# EAGLE design Mainboard (EAGLE 8.1.0)
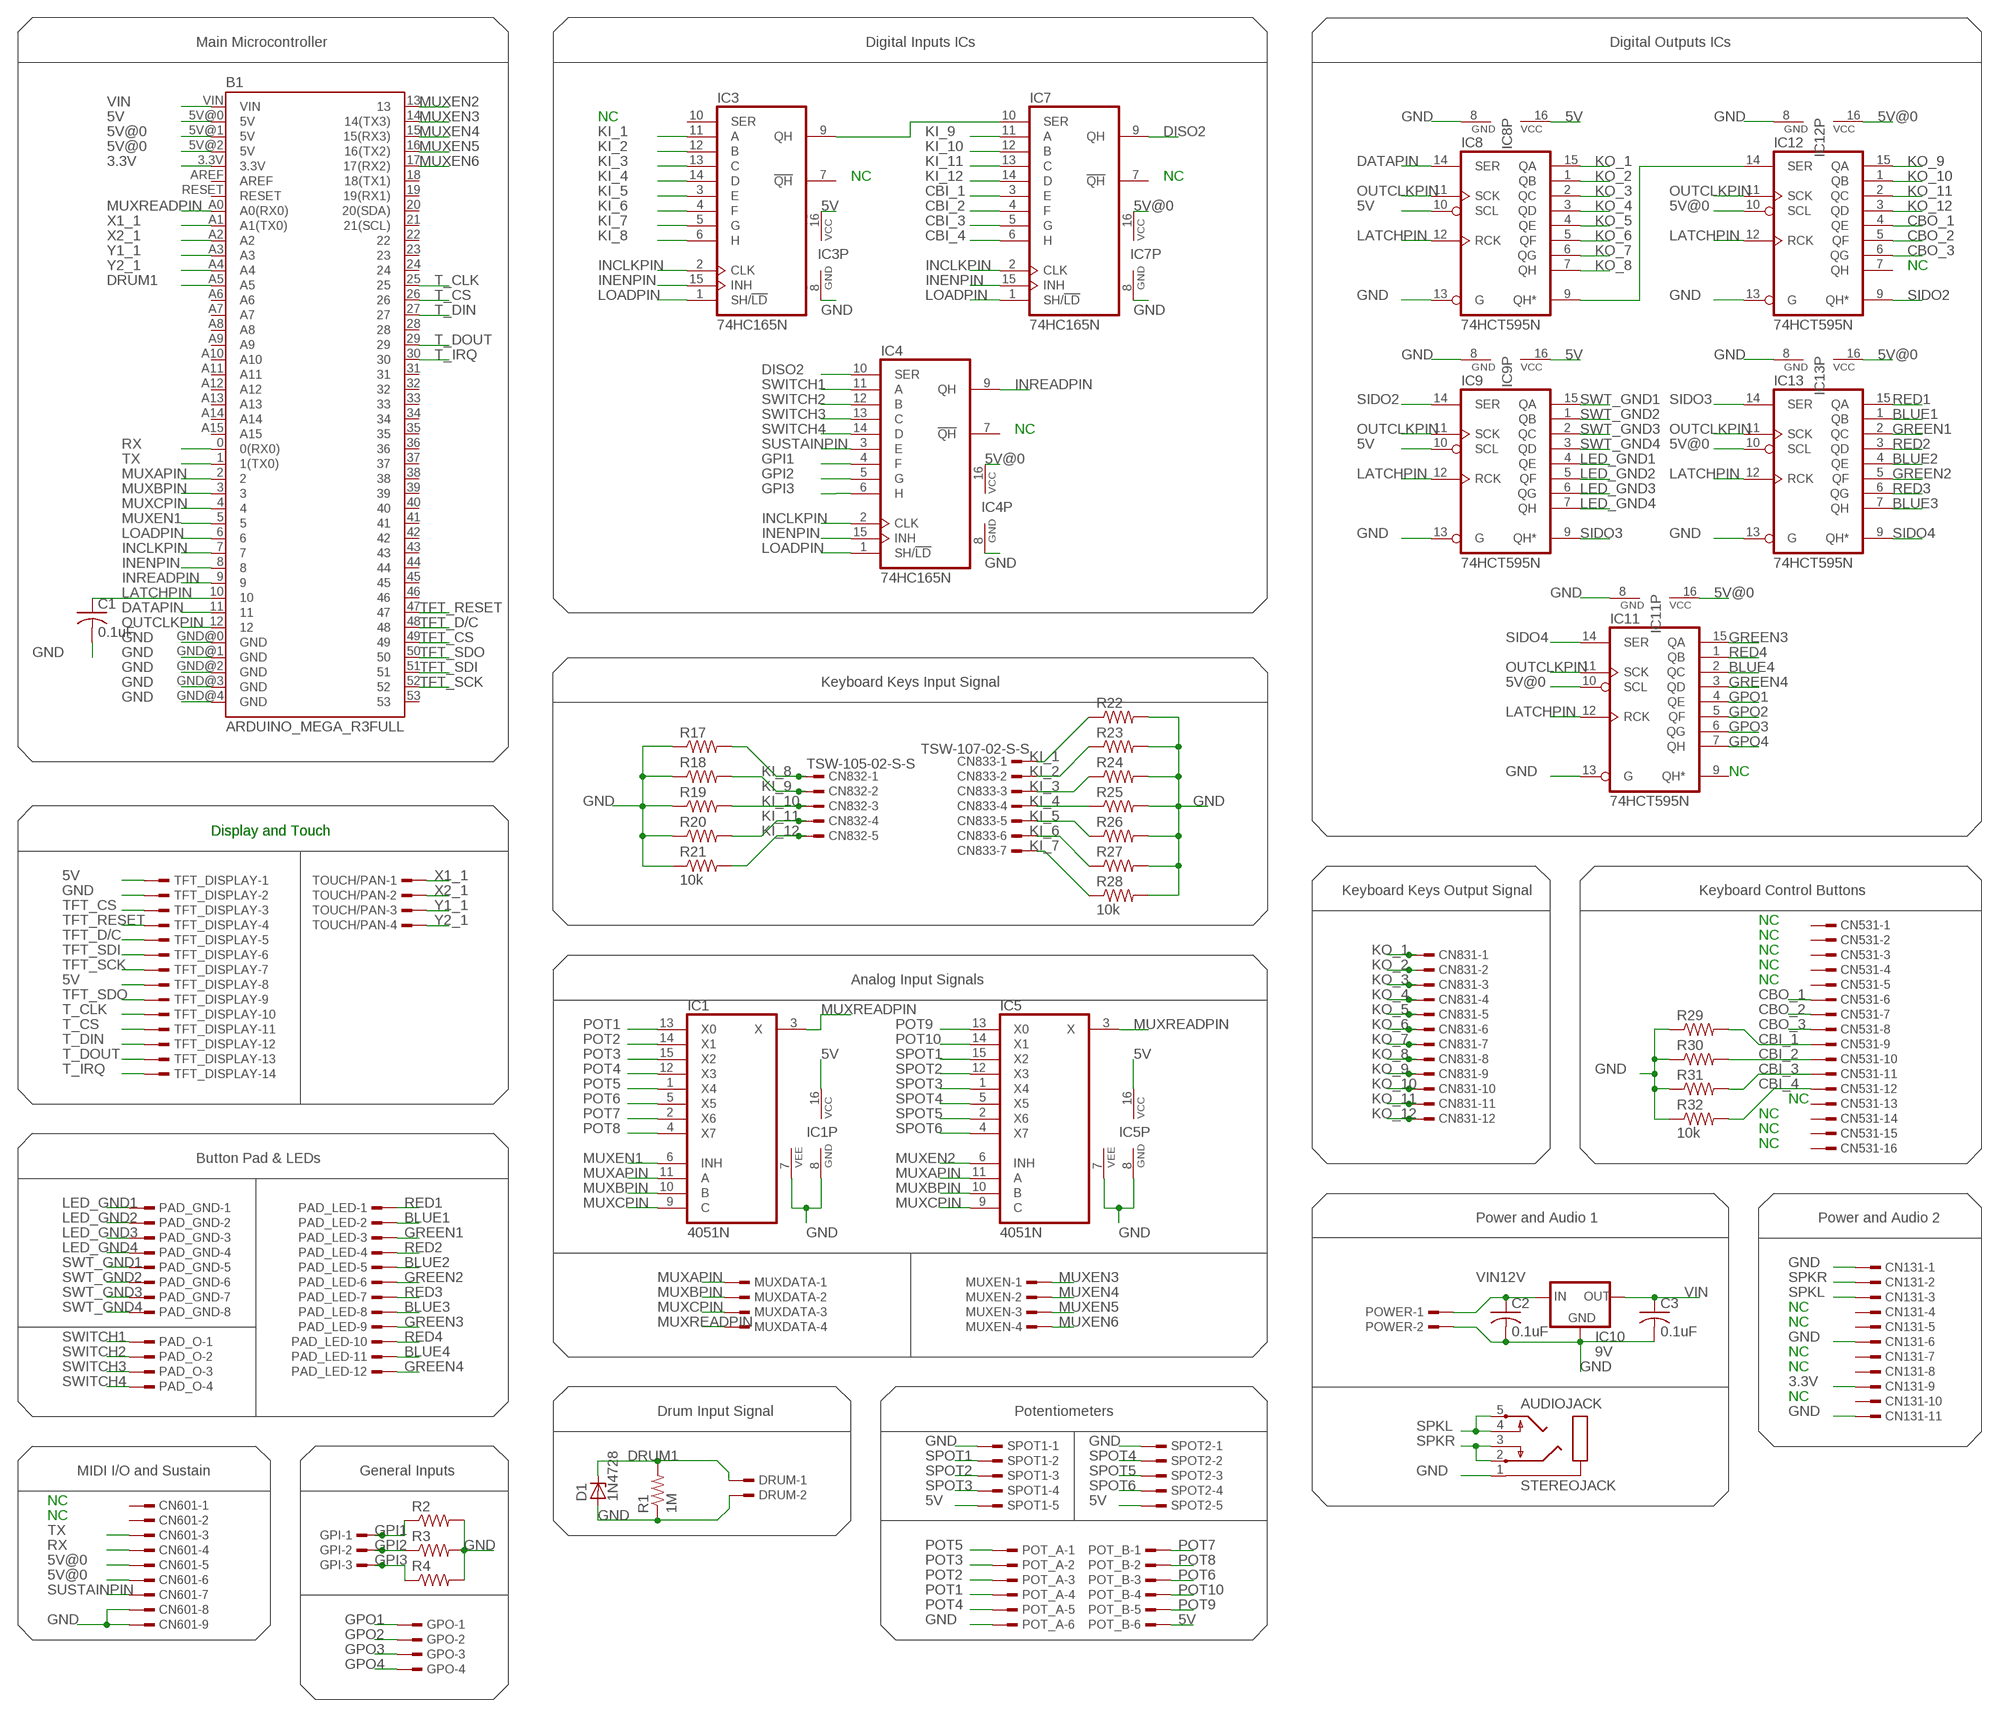
[diagram p0: schematic, sheet 1]

## Parts
AUDIOJACK  STEREOJACK  [STX3100]
B1  ARDUINO_MEGA_R3FULL  [ARDUINO_MEGA]
C1  0.1uF  C-US050-075X075  [C050-075X075]
C2  0.1uF  C-US050-075X075  [C050-075X075]
C3  0.1uF  C-US050-075X075  [C050-075X075]
CN131  TSW-111-02-S-S  [TSW-111-02-S-S]
CN531  TSW-116-02-S-S  [TSW-116-02-S-S]
CN601  TSW-109-02-S-S  [TSW-109-02-S-S]
CN831  TSW-112-02-S-S  [TSW-112-02-S-S]
CN832  TSW-105-02-S-S  [TSW-105-02-S-S]
CN833  TSW-107-02-S-S  [TSW-107-02-S-S]
D1  1N4728  [DO41Z10]
DRUM  TSW-102-02-S-S  [TSW-102-02-S-S]
GPI  TSW-103-02-S-S  [TSW-103-02-S-S]
GPO  TSW-104-02-S-S  [TSW-104-02-S-S]
IC1  4051N  [DIL16]
IC3  74HC165N  [DIL16]
IC4  74HC165N  [DIL16]
IC5  4051N  [DIL16]
IC7  74HC165N  [DIL16]
IC8  74HCT595N  [DIL16]
IC9  74HCT595N  [DIL16]
IC10  9V  78XXL  [78XXL]
IC11  74HCT595N  [DIL16]
IC12  74HCT595N  [DIL16]
IC13  74HCT595N  [DIL16]
MUXDATA  TSW-104-02-S-S  [TSW-104-02-S-S]
MUXEN  TSW-104-02-S-S  [TSW-104-02-S-S]
PAD_GND  TSW-108-02-S-S  [TSW-108-02-S-S]
PAD_LED  TSW-112-02-S-S  [TSW-112-02-S-S]
PAD_O  TSW-104-02-S-S  [TSW-104-02-S-S]
POT_A  TSW-106-02-S-S  [TSW-106-02-S-S]
POT_B  TSW-106-02-S-S  [TSW-106-02-S-S]
POWER  TSW-102-02-S-S  [TSW-102-02-S-S]
R1  1M  R-US_0309/12  [0309/12]
R2  10k  R-US_0309/12  [0309/12]
R3  10k  R-US_0309/12  [0309/12]
R4  10k  R-US_0309/12  [0309/12]
R17  10k  R-US_0309/12  [0309/12]
R18  10k  R-US_0309/12  [0309/12]
R19  10k  R-US_0309/12  [0309/12]
R20  10k  R-US_0309/12  [0309/12]
R21  10k  R-US_0309/12  [0309/12]
R22  10k  R-US_0309/12  [0309/12]
R23  10k  R-US_0309/12  [0309/12]
R24  10k  R-US_0309/12  [0309/12]
R25  10k  R-US_0309/12  [0309/12]
R26  10k  R-US_0309/12  [0309/12]
R27  10k  R-US_0309/12  [0309/12]
R28  10k  R-US_0309/12  [0309/12]
R29  10k  R-US_0309/12  [0309/12]
R30  10k  R-US_0309/12  [0309/12]
R31  10k  R-US_0309/12  [0309/12]
R32  10k  R-US_0309/12  [0309/12]
SPOT1  TSW-105-02-S-S  [TSW-105-02-S-S]
SPOT2  TSW-105-02-S-S  [TSW-105-02-S-S]
TFT_DISPLAY  TSW-114-02-S-S  [TSW-114-02-S-S]
TOUCH/PAN  TSW-104-02-S-S  [TSW-104-02-S-S]

## Nets
3.3V: B1.3.3V CN131.9
5V: B1.5V@0(5V) IC1.16(VCC) IC3.16(VCC) IC5.16(VCC) IC8.10(SCL) IC8.16(VCC) IC9.10(SCL) IC9.16(VCC) POT_B.6 SPOT1.5 SPOT2.5 TFT_DISPLAY.1 TFT_DISPLAY.8
5V@0: B1.5V@1(5V) B1.5V@2(5V) CN601.5 CN601.6 IC4.16(VCC) IC7.16(VCC) IC11.10(SCL) IC11.16(VCC) IC12.10(SCL) IC12.16(VCC) IC13.10(SCL) IC13.16(VCC)
BLUE1: IC13.1(QB) PAD_LED.2
BLUE2: IC13.4(QE) PAD_LED.5
BLUE3: IC13.7(QH) PAD_LED.8
BLUE4: IC11.2(QC) PAD_LED.11
CBI_1: CN531.9 IC7.3(E) R29.2
CBI_2: CN531.10 IC7.4(F) R30.2
CBI_3: CN531.11 IC7.5(G) R31.2
CBI_4: CN531.12 IC7.6(H) R32.2
CBO_1: CN531.6 IC12.4(QE)
CBO_2: CN531.7 IC12.5(QF)
CBO_3: CN531.8 IC12.6(QG)
DATAPIN: B1.11 IC8.14(SER)
DISO1: IC3.9(QH) IC7.10(SER)
DISO2: IC4.10(SER) IC7.9(QH)
DRUM1: B1.A5 D1.C DRUM.1 R1.2
GND: AUDIOJACK.1 B1.GND@0(GND) B1.GND@1(GND) B1.GND@2(GND) B1.GND@3(GND) B1.GND@4(GND) C1.2 C2.2 C3.2 CN131.1 CN131.6 CN131.11 CN601.8 CN601.9 D1.A DRUM.2 IC1.7(VEE) IC1.8(GND) IC3.8(GND) IC4.8(GND) IC5.7(VEE) IC5.8(GND) IC7.8(GND) IC8.8(GND) IC8.13(G) IC9.8(GND) IC9.13(G) IC10.GND IC11.8(GND) IC11.13(G) IC12.8(GND) IC12.13(G) IC13.8(GND) IC13.13(G) POT_A.6 POWER.2 R1.1 R2.2 R3.2 R4.2 R17.1 R18.1 R19.1 R20.1 R21.1 R22.2 R23.2 R24.2 R25.2 R26.2 R27.2 R28.2 R29.1 R30.1 R31.1 R32.1 SPOT1.1 SPOT2.1 TFT_DISPLAY.2
GPI1: GPI.1 IC4.4(F) R2.1
GPI2: GPI.2 IC4.5(G) R3.1
GPI3: GPI.3 IC4.6(H) R4.1
GPO1: GPO.1 IC11.4(QE)
GPO2: GPO.2 IC11.5(QF)
GPO3: GPO.3 IC11.6(QG)
GPO4: GPO.4 IC11.7(QH)
GREEN1: IC13.2(QC) PAD_LED.3
GREEN2: IC13.5(QF) PAD_LED.6
GREEN3: IC11.15(QA) PAD_LED.9
GREEN4: IC11.3(QD) PAD_LED.12
INCLKPIN: B1.7 IC3.2(CLK) IC4.2(CLK) IC7.2(CLK)
INENPIN: B1.8 IC3.15(INH) IC4.15(INH) IC7.15(INH)
INREADPIN: B1.9 IC4.9(QH)
KI_1: CN833.1 IC3.11(A) R22.1
KI_2: CN833.2 IC3.12(B) R23.1
KI_3: CN833.3 IC3.13(C) R24.1
KI_4: CN833.4 IC3.14(D) R25.1
KI_5: CN833.5 IC3.3(E) R26.1
KI_6: CN833.6 IC3.4(F) R27.1
KI_7: CN833.7 IC3.5(G) R28.1
KI_8: CN832.1 IC3.6(H) R17.2
KI_9: CN832.2 IC7.11(A) R18.2
KI_10: CN832.3 IC7.12(B) R19.2
KI_11: CN832.4 IC7.13(C) R20.2
KI_12: CN832.5 IC7.14(D) R21.2
KO_1: CN831.1 IC8.15(QA)
KO_2: CN831.2 IC8.1(QB)
KO_3: CN831.3 IC8.2(QC)
KO_4: CN831.4 IC8.3(QD)
KO_5: CN831.5 IC8.4(QE)
KO_6: CN831.6 IC8.5(QF)
KO_7: CN831.7 IC8.6(QG)
KO_8: CN831.8 IC8.7(QH)
KO_9: CN831.9 IC12.15(QA)
KO_10: CN831.10 IC12.1(QB)
KO_11: CN831.11 IC12.2(QC)
KO_12: CN831.12 IC12.3(QD)
LATCHPIN: B1.10 C1.1 IC8.12(RCK) IC9.12(RCK) IC11.12(RCK) IC12.12(RCK) IC13.12(RCK)
LED_GND1: IC9.4(QE) PAD_GND.1
LED_GND2: IC9.5(QF) PAD_GND.2
LED_GND3: IC9.6(QG) PAD_GND.3
LED_GND4: IC9.7(QH) PAD_GND.4
LOADPIN: B1.6 IC3.1(SH/!LD) IC4.1(SH/!LD) IC7.1(SH/!LD)
MUXAPIN: B1.2 IC1.11(A) IC5.11(A) MUXDATA.1
MUXBPIN: B1.3 IC1.10(B) IC5.10(B) MUXDATA.2
MUXCPIN: B1.4 IC1.9(C) IC5.9(C) MUXDATA.3
MUXEN1: B1.5 IC1.6(INH)
MUXEN2: B1.13 IC5.6(INH)
MUXEN3: B1.14(14(TX3)) MUXEN.1
MUXEN4: B1.15(15(RX3)) MUXEN.2
MUXEN5: B1.16(16(TX2)) MUXEN.3
MUXEN6: B1.17(17(RX2)) MUXEN.4
MUXREADPIN: B1.A0(A0(RX0)) IC1.3(X) IC5.3(X) MUXDATA.4
N$4: IC8.9(QH*) IC12.14(SER)
OUTCLKPIN: B1.12 IC8.11(SCK) IC9.11(SCK) IC11.11(SCK) IC12.11(SCK) IC13.11(SCK)
POT1: IC1.13(X0) POT_A.4
POT2: IC1.14(X1) POT_A.3
POT3: IC1.15(X2) POT_A.2
POT4: IC1.12(X3) POT_A.5
POT5: IC1.1(X4) POT_A.1
POT6: IC1.5(X5) POT_B.3
POT7: IC1.2(X6) POT_B.1
POT8: IC1.4(X7) POT_B.2
POT9: IC5.13(X0) POT_B.5
POT10: IC5.14(X1) POT_B.4
RED1: IC13.15(QA) PAD_LED.1
RED2: IC13.3(QD) PAD_LED.4
RED3: IC13.6(QG) PAD_LED.7
RED4: IC11.1(QB) PAD_LED.10
RX: B1.0(0(RX0)) CN601.4
SIDO2: IC9.14(SER) IC12.9(QH*)
SIDO3: IC9.9(QH*) IC13.14(SER)
SIDO4: IC11.14(SER) IC13.9(QH*)
SPKL: AUDIOJACK.4 AUDIOJACK.5 CN131.3
SPKR: AUDIOJACK.2 AUDIOJACK.3 CN131.2
SPOT1: IC5.15(X2) SPOT1.2
SPOT2: IC5.12(X3) SPOT1.3
SPOT3: IC5.1(X4) SPOT1.4
SPOT4: IC5.5(X5) SPOT2.2
SPOT5: IC5.2(X6) SPOT2.3
SPOT6: IC5.4(X7) SPOT2.4
SUSTAINPIN: CN601.7 IC4.3(E)
SWITCH1: IC4.11(A) PAD_O.1
SWITCH2: IC4.12(B) PAD_O.2
SWITCH3: IC4.13(C) PAD_O.3
SWITCH4: IC4.14(D) PAD_O.4
SWT_GND1: IC9.15(QA) PAD_GND.5
SWT_GND2: IC9.1(QB) PAD_GND.6
SWT_GND3: IC9.2(QC) PAD_GND.7
SWT_GND4: IC9.3(QD) PAD_GND.8
T_CLK: B1.25 TFT_DISPLAY.10
T_CS: B1.26 TFT_DISPLAY.11
T_DIN: B1.27 TFT_DISPLAY.12
T_DOUT: B1.29 TFT_DISPLAY.13
T_IRQ: B1.30 TFT_DISPLAY.14
TFT_CS: B1.49 TFT_DISPLAY.3
TFT_D/C: B1.48 TFT_DISPLAY.5
TFT_RESET: B1.47 TFT_DISPLAY.4
TFT_SCK: B1.52 TFT_DISPLAY.7
TFT_SDI: B1.51 TFT_DISPLAY.6
TFT_SDO: B1.50 TFT_DISPLAY.9
TX: B1.1(1(TX0)) CN601.3
VIN: B1.VIN C3.1 IC10.OUT
VIN12V: C2.1 IC10.IN POWER.1
X1_1: B1.A1(A1(TX0)) TOUCH/PAN.1
X2_1: B1.A2 TOUCH/PAN.2
Y1_1: B1.A3 TOUCH/PAN.3
Y2_1: B1.A4 TOUCH/PAN.4
Unconnected: B1.18(18(TX1)) B1.19(19(RX1)) B1.20(20(SDA)) B1.21(21(SCL)) B1.22 B1.23 B1.24 B1.28 B1.31 B1.32 B1.33 B1.34 B1.35 B1.36 B1.37 B1.38 B1.39 B1.40 B1.41 B1.42 B1.43 B1.44 B1.45 B1.46 B1.53 B1.A6 B1.A7 B1.A8 B1.A9 B1.A10 B1.A11 B1.A12 B1.A13 B1.A14 B1.A15 B1.AREF B1.RESET CN131.4 CN131.5 CN131.7 CN131.8 CN131.10 CN531.1 CN531.2 CN531.3 CN531.4 CN531.5 CN531.13 CN531.14 CN531.15 CN531.16 CN601.1 CN601.2 IC3.7(!QH) IC3.10(SER) IC4.7(!QH) IC7.7(!QH) IC11.9(QH*) IC12.7(QH)

## Notes on the sheet
- Main Microcontroller | Digital Inputs ICs | Digital Outputs ICs
- NC
- NC | NC
- NC
- NC
- Keyboard Keys Input Signal
- NC
- Display and Touch | Display and Touch
- Keyboard Keys Output Signal | Keyboard Control Buttons
- NC
- NC
- NC
- NC
- Analog Input Signals | NC
- NC
- NC
- NC
- NC
- Button Pad & LEDs
- Power and Audio 1 | Power and Audio 2
- NC
- NC
- NC
- NC
- NC
- Drum Input Signal | Potentiometers
- MIDI I/O and Sustain | General Inputs
- NC
- NC

## Library data of the parts
AUDIOJACK = adafruit:STEREOJACK: MIC/HEADPHONE JACK Stereo jack with two switches. Kycon STX3100, CUI SJ1-3555NG and/or 4UCon 05544
B1 = SparkFun-Boards1:ARDUINO_MEGA_R3: Arduino Mega R3 ATmega2560 R3 compatible footprint. SparkFun Products: Arduino Mega 2560 R3 <https://www.sparkfun.com/products/11061>
C1-C3 = resistor:C-US: CAPACITOR, American symbol
CN131 = con-samtec:TSW-111-02-S-S: THROUGH-HOLE .025" SQ POST HEADER Source: Samtec TSW.pdf; OC_FARNELL: unknown; OC_NEWARK: unknown
CN531 = con-samtec:TSW-116-02-S-S: THROUGH-HOLE .025" SQ POST HEADER Source: Samtec TSW.pdf; OC_FARNELL: unknown; OC_NEWARK: unknown
CN601 = con-samtec:TSW-109-02-S-S: THROUGH-HOLE .025" SQ POST HEADER Source: Samtec TSW.pdf; OC_FARNELL: unknown; OC_NEWARK: unknown
CN831 PAD_LED = con-samtec:TSW-112-02-S-S: THROUGH-HOLE .025" SQ POST HEADER Source: Samtec TSW.pdf; OC_FARNELL: unknown; OC_NEWARK: unknown
CN832 SPOT1 SPOT2 = con-samtec:TSW-105-02-S-S: THROUGH-HOLE .025" SQ POST HEADER Source: Samtec TSW.pdf; OC_FARNELL: unknown; OC_NEWARK: unknown
CN833 = con-samtec:TSW-107-02-S-S: THROUGH-HOLE .025" SQ POST HEADER Source: Samtec TSW.pdf; OC_FARNELL: unknown; OC_NEWARK: unknown
D1 = diode:1N4728: Z DIODE 3.3 V, 1W, 5 percent
DRUM POWER = con-samtec:TSW-102-02-S-S: THROUGH-HOLE .025" SQ POST HEADER Source: Samtec TSW.pdf; OC_FARNELL: unknown; OC_NEWARK: unknown
GPI = con-samtec:TSW-103-02-S-S: THROUGH-HOLE .025" SQ POST HEADER Source: Samtec TSW.pdf; OC_FARNELL: unknown; OC_NEWARK: unknown
GPO MUXDATA MUXEN PAD_O TOUCH/PAN = con-samtec:TSW-104-02-S-S: THROUGH-HOLE .025" SQ POST HEADER Source: Samtec TSW.pdf; OC_FARNELL: unknown; OC_NEWARK: unknown
IC1 IC5 = 40xx:4051: 8-channel ANALOG MULTIPLEXER
IC3 IC4 IC7 = 74xx-eu:74*165: 8-bit parallel load SHIFT REGISTER
IC8 IC9 IC11-IC13 = 74xx-eu:74*595: 8-bit SHIFT REGISTER, output latch
IC10 = v-reg:78XXL: VOLTAGE REGULATOR
PAD_GND = con-samtec:TSW-108-02-S-S: THROUGH-HOLE .025" SQ POST HEADER Source: Samtec TSW.pdf; OC_FARNELL: unknown; OC_NEWARK: unknown
POT_A POT_B = con-samtec:TSW-106-02-S-S: THROUGH-HOLE .025" SQ POST HEADER Source: Samtec TSW.pdf; OC_FARNELL: unknown; OC_NEWARK: unknown
R1-R4 R17-R32 = rcl:R-US_: RESISTOR, American symbol
TFT_DISPLAY = con-samtec:TSW-114-02-S-S: THROUGH-HOLE .025" SQ POST HEADER Source: Samtec TSW.pdf; OC_FARNELL: unknown; OC_NEWARK: unknown

## Net classes
0 default: width 0.35 mm, drill 0.9 mm, clearance 0.3 mm

## Board
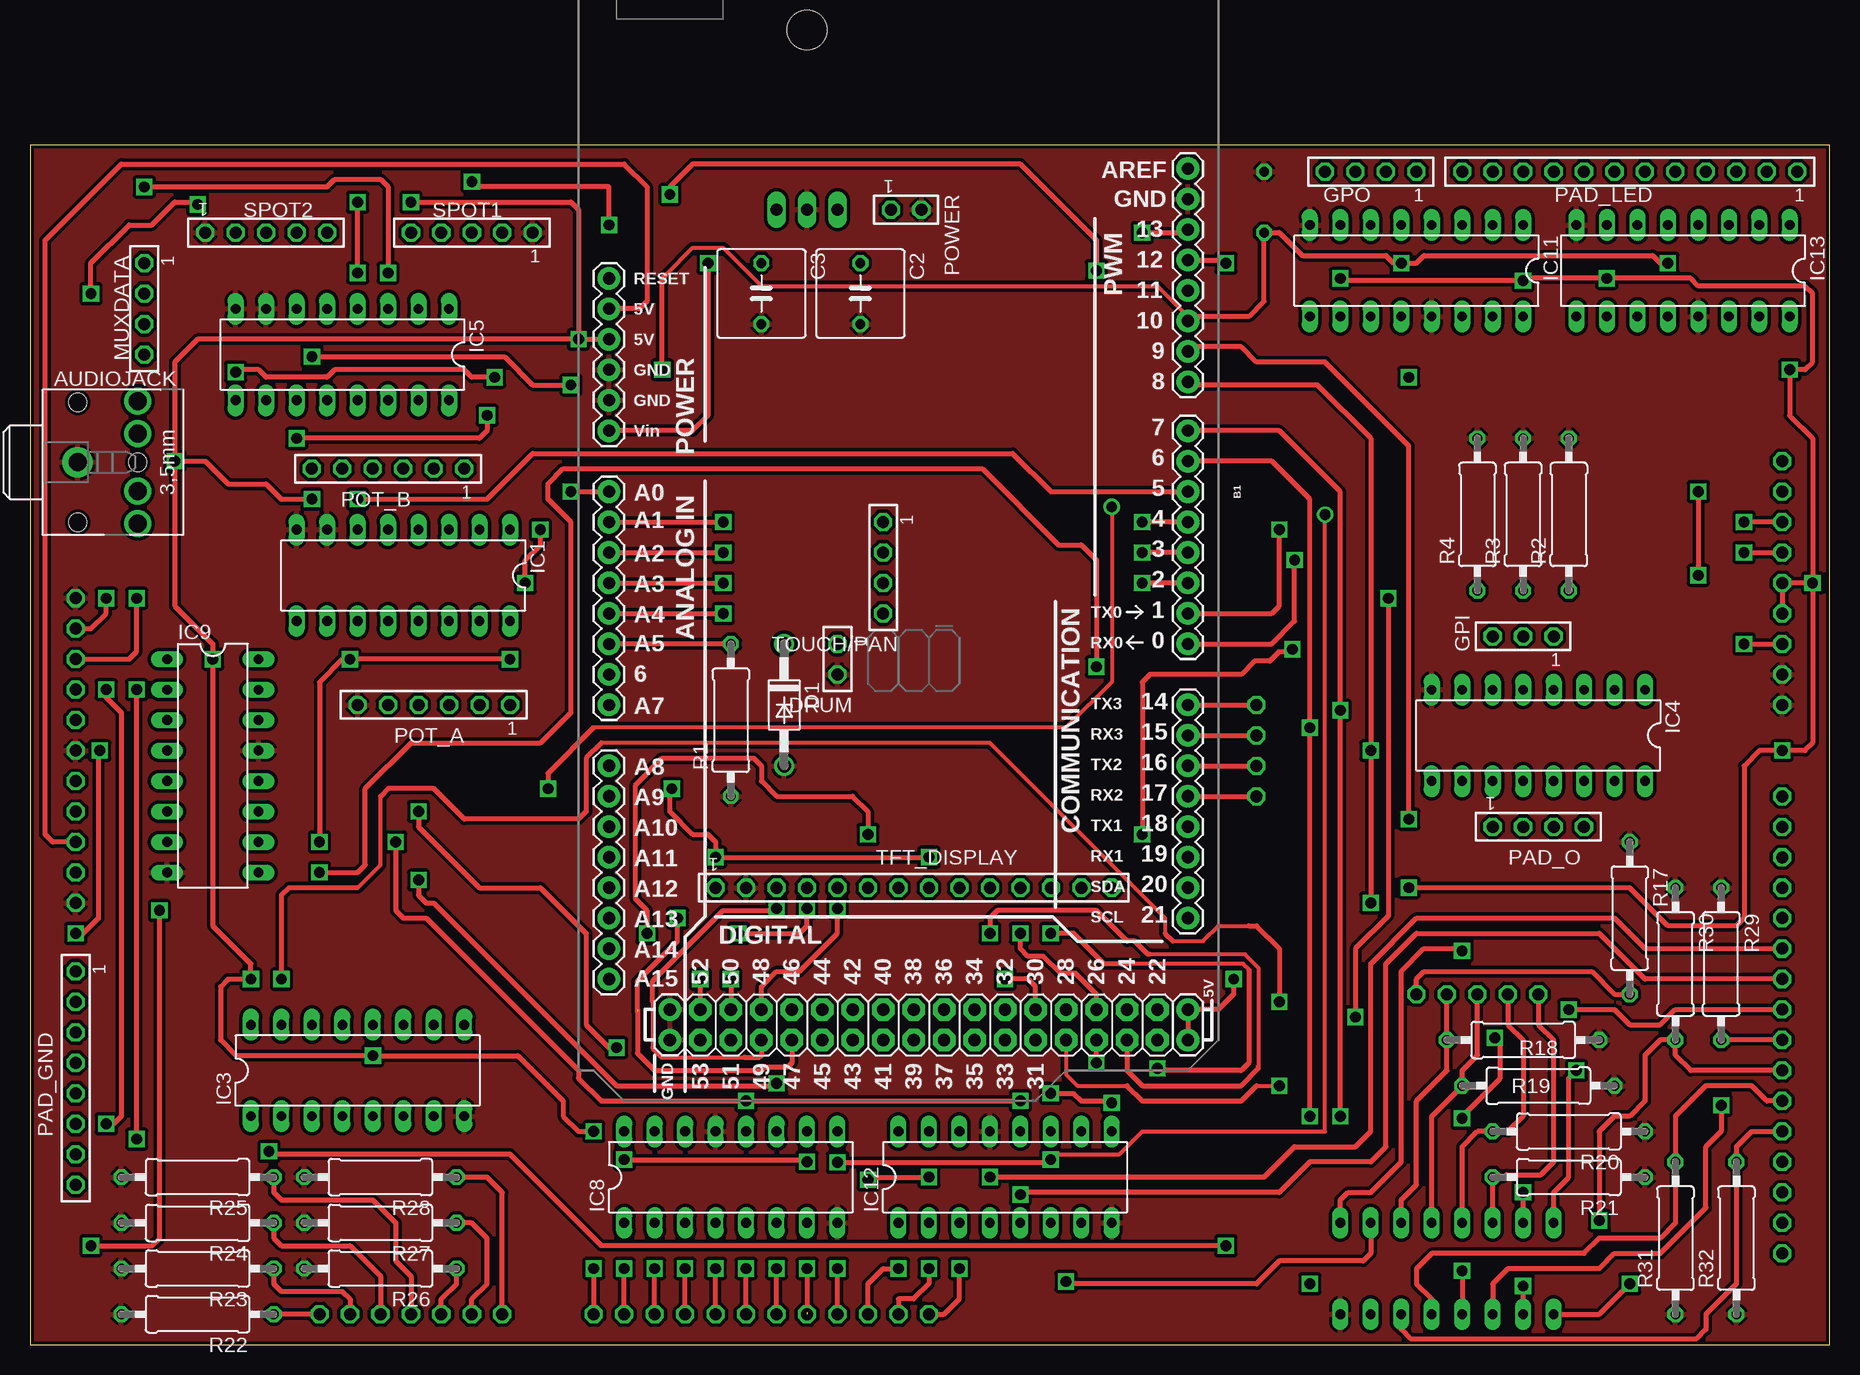
[diagram p1: board, top side]
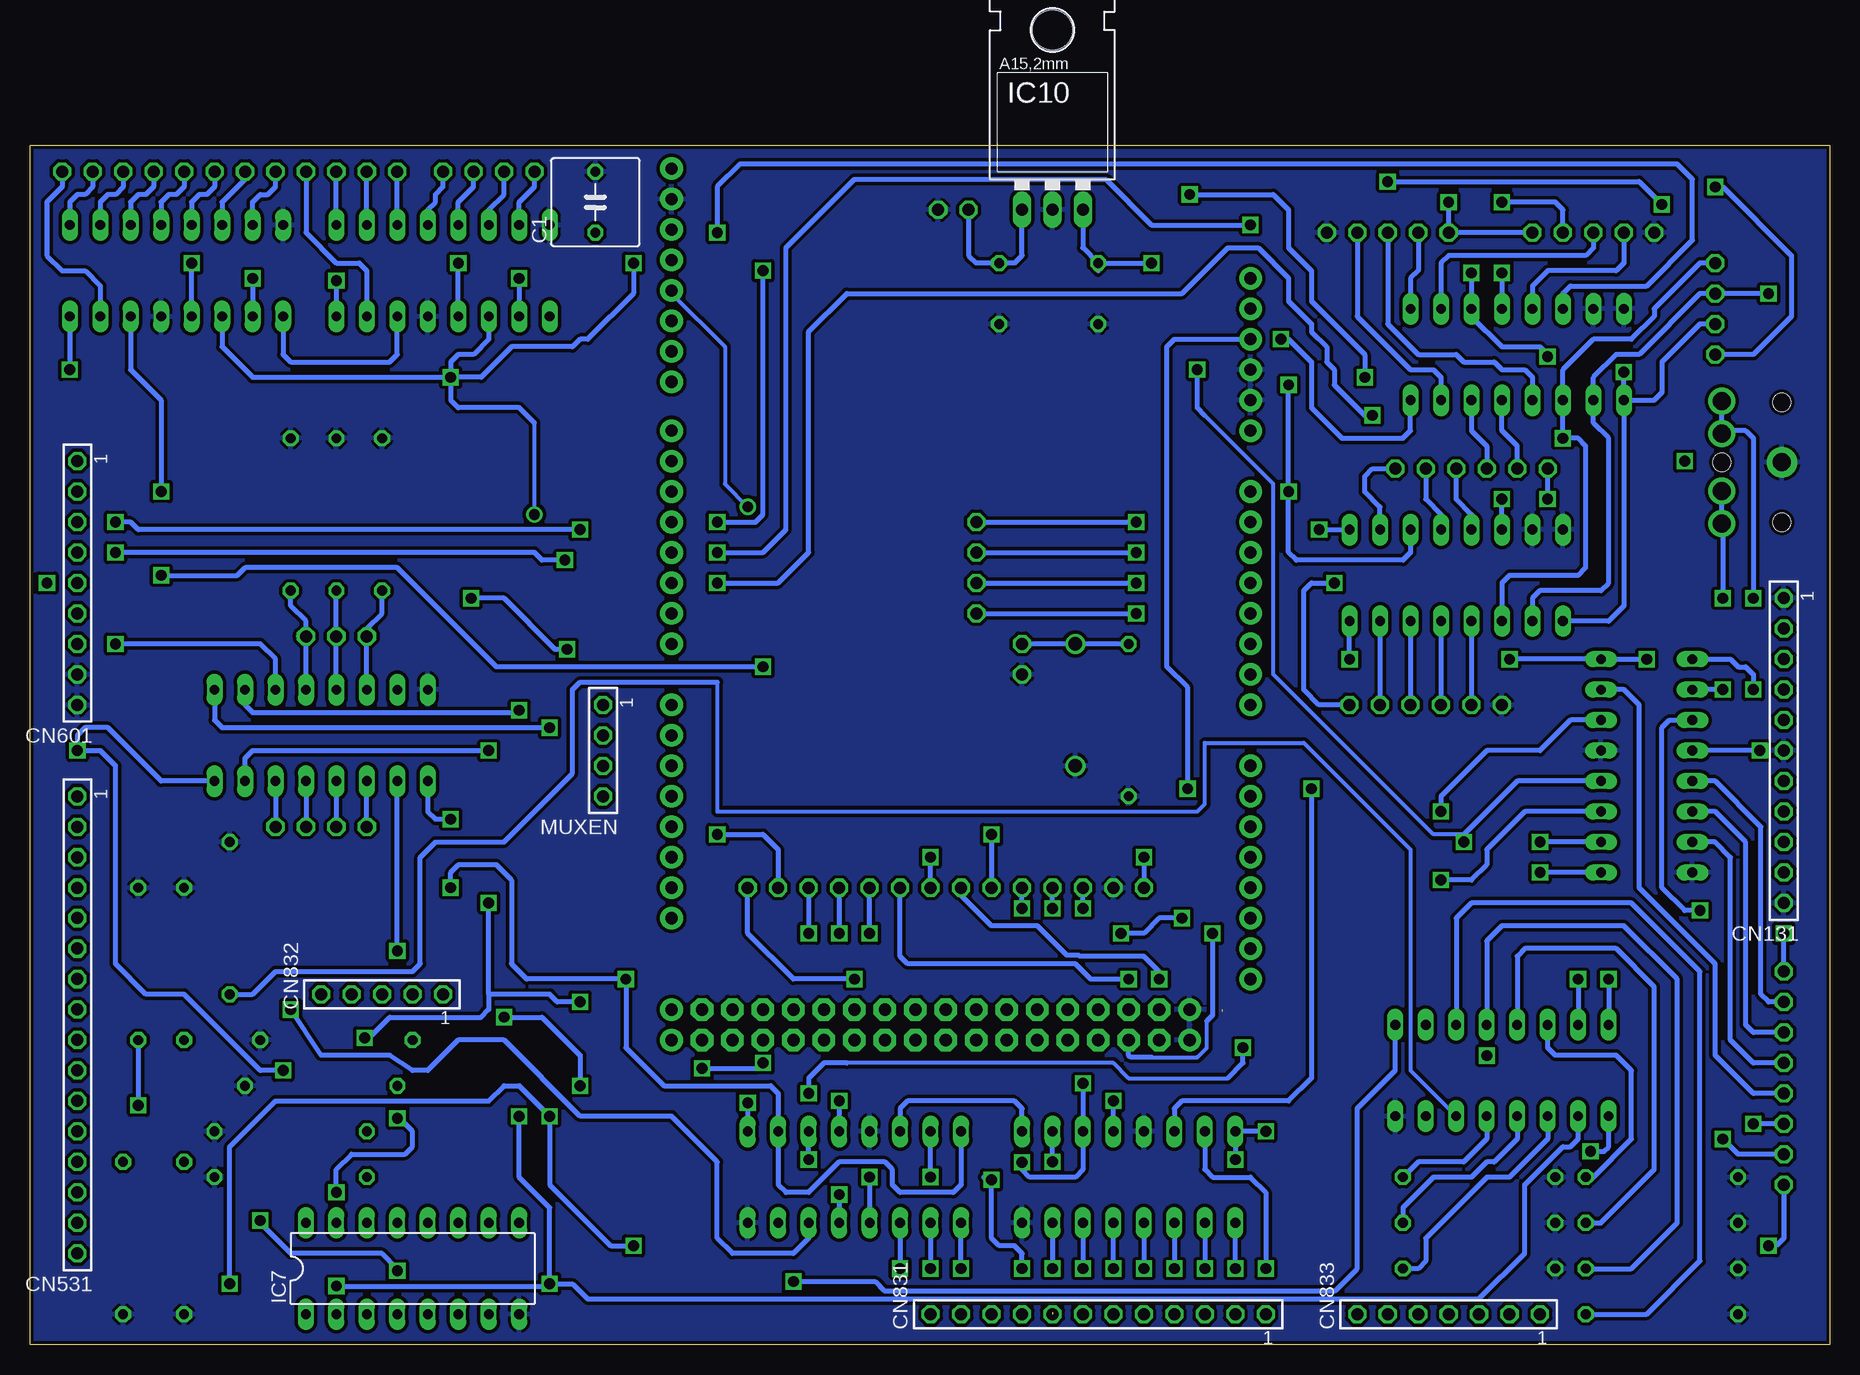
[diagram p2: board, bottom side, seen from below]

Size 150 x 100 mm. Coordinates in mm from the lower left corner, seen from the top.
Outline: 0,0 150,0 150,100 0,100 0,0
Copper layers (1*16): Top 0.035mm / dielectric 0.35mm / Bottom 0.035mm
Design rules "default *": minimum track width 0.35mm, minimum drill 24mil, track to track 0.3mm, track to pad 0.3mm, pad to pad 8mil, via to via 8mil, smd to smd 8mil, copper to edge 0.3mm, drill to drill 8mil, minimum pad ring 10mil, minimum via ring 8mil, stop-mask expansion 4mil, vias tented up to drill 0mil, thermal gap 10mil

### Footprints (pad centres in the part's own frame; a part is rotated, then mirrored left to right if it is on the bottom)
STX3100 = drill 1.5 pad 2.54: 1 2.7,-0.1 | drill 1.5: 2 7.7,5; 3 7.7,2.3; 4 7.7,-2.5; 5 7.7,-5.2 | hole 1.5: 2.7,4.9; 2.7,-5.1; 7.7,-0.1
ARDUINO_MEGA = drill 1.016 pad 1.88: 0 13.97,24.13; 1 11.43,24.13; 2 8.89,24.13; 3 6.35,24.13; 3.3V -13.97,-24.13; 4 3.81,24.13; 5 1.27,24.13; 5V@0 -11.43,-24.13; 5V@1 44.45,24.13; 5V@2 46.99,24.13; 6 -1.27,24.13; 7 -3.81,24.13; 8 -7.874,24.13; 9 -10.414,24.13; 10 -12.954,24.13; 11 -15.494,24.13; 12 -18.034,24.13; 13 -20.574,24.13; 14 19.05,24.13; 15 21.59,24.13; 16 24.13,24.13; 17 26.67,24.13; 18 29.21,24.13; 19 31.75,24.13; 20 34.29,24.13; 21 36.83,24.13; A0 1.27,-24.13; A1 3.81,-24.13; A2 6.35,-24.13; A3 8.89,-24.13; A4 11.43,-24.13; A5 13.97,-24.13; A6 16.51,-24.13; A7 19.05,-24.13; A8 24.13,-24.13; A9 26.67,-24.13; A10 29.21,-24.13; A11 31.75,-24.13; A12 34.29,-24.13; A13 36.83,-24.13; A14 39.37,-24.13; A15 41.91,-24.13; AREF -25.654,24.13; GND@0 -8.89,-24.13; GND@1 -6.35,-24.13; GND@2 44.45,-19.05; GND@3 46.99,-19.05; GND@4 -23.114,24.13; RESET -16.51,-24.13; VIN -3.81,-24.13 | drill 1.016 pad 1.88 octagon: 22 44.45,21.59; 23 46.99,21.59; 24 44.45,19.05; 25 46.99,19.05; 26 44.45,16.51; 27 46.99,16.51; 28 44.45,13.97; 29 46.99,13.97; 30 44.45,11.43; 31 46.99,11.43; 32 44.45,8.89; 33 46.99,8.89; 34 44.45,6.35; 35 46.99,6.35; 36 44.45,3.81; 37 46.99,3.81; 38 44.45,1.27; 39 46.99,1.27; 40 44.45,-1.27; 41 46.99,-1.27; 42 44.45,-3.81; 43 46.99,-3.81; 44 44.45,-6.35; 45 46.99,-6.35; 46 44.45,-8.89; 47 46.99,-8.89; 48 44.45,-11.43; 49 46.99,-11.43; 50 44.45,-13.97; 51 46.99,-13.97; 52 44.45,-16.51; 53 46.99,-16.51
C050-075X075 = drill 0.813 octagon: 1 -2.54,0; 2 2.54,0
TSW-111-02-S-S = drill 1 pad 1.5 octagon: 1 12.7,0; 2 10.16,0; 3 7.62,0; 4 5.08,0; 5 2.54,0; 6 0,0; 7 -2.54,0; 8 -5.08,0; 9 -7.62,0; 10 -10.16,0; 11 -12.7,0
TSW-116-02-S-S = drill 1 pad 1.5 octagon: 1 19.05,0; 2 16.51,0; 3 13.97,0; 4 11.43,0; 5 8.89,0; 6 6.35,0; 7 3.81,0; 8 1.27,0; 9 -1.27,0; 10 -3.81,0; 11 -6.35,0; 12 -8.89,0; 13 -11.43,0; 14 -13.97,0; 15 -16.51,0; 16 -19.05,0
TSW-109-02-S-S = drill 1 pad 1.5 octagon: 1 10.16,0; 2 7.62,0; 3 5.08,0; 4 2.54,0; 5 0,0; 6 -2.54,0; 7 -5.08,0; 8 -7.62,0; 9 -10.16,0
TSW-112-02-S-S = drill 1 pad 1.5 octagon: 1 13.97,0; 2 11.43,0; 3 8.89,0; 4 6.35,0; 5 3.81,0; 6 1.27,0; 7 -1.27,0; 8 -3.81,0; 9 -6.35,0; 10 -8.89,0; 11 -11.43,0; 12 -13.97,0
TSW-105-02-S-S = drill 1 pad 1.5 octagon: 1 5.08,0; 2 2.54,0; 3 0,0; 4 -2.54,0; 5 -5.08,0
TSW-107-02-S-S = drill 1 pad 1.5 octagon: 1 7.62,0; 2 5.08,0; 3 2.54,0; 4 0,0; 5 -2.54,0; 6 -5.08,0; 7 -7.62,0
DO41Z10 = drill 1.118: A 5.08,0; C -5.08,0
TSW-102-02-S-S = drill 1 pad 1.5 octagon: 1 1.27,0; 2 -1.27,0
TSW-103-02-S-S = drill 1 pad 1.5 octagon: 1 2.54,0; 2 0,0; 3 -2.54,0
TSW-104-02-S-S = drill 1 pad 1.5 octagon: 1 3.81,0; 2 1.27,0; 3 -1.27,0; 4 -3.81,0
DIL16 = drill 0.813 long: 1 -8.89,-3.81; 2 -6.35,-3.81; 3 -3.81,-3.81; 4 -1.27,-3.81; 5 1.27,-3.81; 6 3.81,-3.81; 7 6.35,-3.81; 8 8.89,-3.81; 9 8.89,3.81; 10 6.35,3.81; 11 3.81,3.81; 12 1.27,3.81; 13 -1.27,3.81; 14 -3.81,3.81; 15 -6.35,3.81; 16 -8.89,3.81
78XXL = drill 1.016 long: GND 0,-3.81; IN -2.54,-3.81; OUT 2.54,-3.81 | hole 3.302: 0,11.176
TSW-108-02-S-S = drill 1 pad 1.5 octagon: 1 8.89,0; 2 6.35,0; 3 3.81,0; 4 1.27,0; 5 -1.27,0; 6 -3.81,0; 7 -6.35,0; 8 -8.89,0
TSW-106-02-S-S = drill 1 pad 1.5 octagon: 1 6.35,0; 2 3.81,0; 3 1.27,0; 4 -1.27,0; 5 -3.81,0; 6 -6.35,0
0309/12 = drill 0.813 octagon: 1 -6.35,0; 2 6.35,0
TSW-114-02-S-S = drill 1 pad 1.5 octagon: 1 16.51,0; 2 13.97,0; 3 11.43,0; 4 8.89,0; 5 6.35,0; 6 3.81,0; 7 1.27,0; 8 -1.27,0; 9 -3.81,0; 10 -6.35,0; 11 -8.89,0; 12 -11.43,0; 13 -13.97,0; 14 -16.51,0

### Placement (x,y rotation side)
AUDIOJACK  1.27,73.66 0 top
B1  72.39,72.39 270 top
C1  102.87,95.25 90 bottom
C2  69.22,87.63 270 top
C3  60.96,87.63 270 top
CN131  3.81,49.53 90 bottom
CN531  146.05,26.67 90 bottom
CN601  146.05,63.5 90 bottom
CN831  60.96,2.54 0 bottom
CN832  120.65,29.21 0 bottom
CN833  31.75,2.54 0 bottom
D1  62.87,53.34 270 top
DRUM  67.31,57.15 90 top
GPI  124.46,59.05 0 top
GPO  111.76,97.79 0 top
IC1  31.11,64.14 180 top
IC3  27.3,22.86 0 top
IC4  125.73,50.8 180 top
IC5  26.04,82.55 180 top
IC7  118.11,6.35 0 bottom
IC8  58.42,13.97 0 top
IC9  15.24,48.26 270 top
IC10  64.77,98.42 0 bottom
IC11  115.57,89.53 180 top
IC12  81.28,13.97 0 top
IC13  137.79,89.53 180 top
MUXDATA  9.53,86.36 90 top
MUXEN  102.23,49.53 90 bottom
PAD_GND  3.81,22.23 90 top
PAD_LED  133.35,97.79 0 top
PAD_O  125.73,43.18 180 top
POT_A  33.66,53.34 0 top
POT_B  29.84,73.03 0 top
POWER  73.03,94.61 180 top
R1  58.42,52.07 90 top
R2  128.27,69.22 90 top
R3  124.46,69.22 90 top
R4  120.65,69.22 90 top
R17  133.35,35.56 270 top
R18  124.46,25.4 180 top
R19  125.73,21.59 180 top
R20  128.27,17.78 180 top
R21  128.27,13.97 180 top
R22  13.97,2.54 180 top
R23  13.97,6.35 180 top
R24  13.97,10.16 180 top
R25  13.97,13.97 180 top
R26  29.21,6.35 180 top
R27  29.21,10.16 180 top
R28  29.21,13.97 180 top
R29  140.97,31.75 270 top
R30  137.16,31.75 270 top
R31  137.16,8.89 90 top
R32  142.24,8.89 90 top
SPOT1  36.83,92.71 0 top
SPOT2  19.68,92.71 180 top
TFT_DISPLAY  73.66,38.1 180 top
TOUCH/PAN  71.12,64.77 90 top

### Tracks (layer width: path | path; a pad name or v marks a point on that pad's centre or on a via)
3.3V
  Top 0.406: CN131.9 1.91,41.91 1.27,42.55 1.27,92.08 7.62,98.42 49.53,98.42 51.44,96.52 51.44,87 50.8,86.36 B1.3.3V
5V  (via drill 0.9)
  Top 0.406: v45.72,83.82 45.72,94.61 45.09,95.25 v31.75,95.25 | v45.72,83.82 B1.5V@0 | v45.72,83.82 13.97,83.82 12.06,81.92 v12.06,73.66 | v12.06,73.66 12.06,61.59 15.24,58.42 v15.24,57.15 15.24,34.92 18.41,31.75 v18.41,30.48 16.51,30.48 15.88,29.84 15.88,25.4 17.14,24.13 28.54,24.13 v28.57,24.09 40.67,24.09 44.45,20.32 44.45,19.05 45.72,17.78 v46.99,17.78 | v40.01,57.15 v26.67,57.15 26.04,57.15 24.13,55.24 v24.13,41.91 | v12.06,73.66 14.61,73.66 16.51,71.75 19.68,71.75 20.95,70.48 v23.5,70.48 | v49.53,15.43 64.58,15.43 v64.77,15.24 | v74.93,40.64 v57.15,40.64 57.15,41.91 56.52,42.55 55.24,42.55 53.34,44.45 53.34,46.2 v53.5,46.35
  Bottom 0.406: SPOT2.5 SPOT1.5 v31.75,95.25 | v15.24,57.15 IC9.16 v26.67,57.15 | v18.41,30.48 IC3.16 | v40.01,57.15 IC1.16 | IC9.10 v24.13,41.91 | v45.72,83.82 45.09,83.82 43.18,81.92 43.18,78.11 40.64,75.56 35.56,75.56 34.92,76.2 IC5.16 | v23.5,70.48 POT_B.6 | v49.53,15.43 IC8.16 v46.99,17.78 | v64.77,15.24 IC8.10 | v57.15,40.64 TFT_DISPLAY.1 | TFT_DISPLAY.8 v74.93,40.64 | v53.5,46.35 53.5,54.77 55.24,56.52 55.24,83.19 54.61,83.82 B1.5V@0
5V@0  (via drill 0.9)
  Top 0.406: B1.5V@2 B1.5V@1 99.06,27.94 100.33,29.21 v100.33,30.48 | CN601.6 CN601.5 147.96,63.5 148.59,62.87 | IC7.16 127,12.7 128.27,13.97 128.27,22.23 v128.91,22.86 | 148.59,62.87 148.59,50.16 147.96,49.53 v146.05,49.53 144.15,49.53 142.88,48.26 142.88,35.56 142.24,34.92 136.53,34.92 133.35,38.1 v114.94,38.1 | 148.59,62.87 v148.59,63.5 148.59,75.56 146.69,77.47 v146.69,81.28 147.96,81.28 148.59,81.92 148.59,87.63 147.96,88.27 139.06,88.27 138.43,88.9 v131.44,88.9 124.65,88.9 v124.46,88.71 109.41,88.71 v109.22,88.9
  Bottom 0.406: v128.91,22.86 130.81,22.86 137.16,29.21 140.34,29.21 142.88,31.75 142.88,48.26 144.15,49.53 v146.05,49.53 146.05,50.8 145.41,51.44 143.51,51.44 139.06,46.99 IC4.16 | v114.94,38.1 114.94,39.37 114.3,40.01 111.12,40.01 109.86,38.73 109.86,31.75 108.58,30.48 v100.33,30.48 100.33,24.77 97.16,21.59 88.27,21.59 87.63,20.95 IC12.10 87.63,13.34 87,12.7 85.09,12.7 82.55,15.24 78.74,15.24 78.11,14.61 78.11,13.34 77.47,12.7 73.03,12.7 72.39,13.34 IC12.16 | v131.44,88.9 IC13.10 | IC13.16 v146.69,81.28 | v124.46,88.71 IC11.16 | v109.22,88.9 IC11.10
BLUE1
  Bottom 0.406: PAD_LED.2 144.78,96.52 145.41,95.89 146.05,95.89 146.69,95.25 IC13.1
BLUE2
  Bottom 0.406: PAD_LED.5 137.16,96.52 137.79,95.89 138.43,95.89 139.06,95.25 IC13.4
BLUE3
  Bottom 0.406: IC13.7 131.44,95.25 130.81,95.89 130.18,95.89 129.54,96.52 PAD_LED.8
BLUE4
  Bottom 0.406: IC11.2 PAD_LED.11
CBI_1  (via drill 0.9)
  Top 0.406: CN531.9 R29.2 | v140.97,19.95 140.97,17.78 139.7,16.51 139.7,11.43 135.89,7.62 132.08,7.62 130.81,6.35 123.19,6.35 121.92,5.08 IC7.3 121.92,3.81
  Bottom 0.406: R29.2 v140.97,19.95
CBI_2  (via drill 0.9)
  Top 0.406: CN531.10 138.43,22.86 137.16,24.13 R30.2 135.89,25.4 134.62,24.13 134.62,20.32 133.35,19.05 132.08,19.05 130.81,17.78 v130.81,10.35 | v119.38,6.16 IC7.4
  Bottom 0.406: v130.81,10.35 130.81,10.16 128.27,7.62 120.65,7.62 119.38,6.35 v119.38,6.16
CBI_3
  Top 0.406: CN531.11 144.78,20.32 143.51,21.59 139.7,21.59 137.16,19.05 R31.2 137.16,10.16 135.89,8.89 130.81,8.89 129.54,7.62 116.84,7.62 115.57,6.35 115.57,5.08 116.84,3.81 IC7.5
CBI_4
  Top 0.406: CN531.12 143.51,17.78 142.24,16.51 R32.2 142.24,5.08 139.7,2.54 139.7,1.27 138.93,0.5 115.07,0.5 114.3,1.27 IC7.6
CBO_1  (via drill 0.9)
  Top 0.406: CN531.6 134.62,33.02 132.08,35.56 115.57,35.56 111.76,31.75 111.76,17.78 110.49,16.51 105.41,16.51 102.87,13.97 v80.01,13.97
  Bottom 0.406: v80.01,13.97 IC12.4
CBO_2  (via drill 0.9)
  Top 0.406: CN531.7 134.62,30.48 130.81,34.29 115.57,34.29 113.03,31.75 113.03,16.51 111.76,15.24 106.68,15.24 104.14,12.7 82.74,12.7 v82.55,12.51
  Bottom 0.406: v82.55,12.51 IC12.5
CBO_3  (via drill 0.9)
  Top 0.406: v128.27,27.94 132.08,27.94 133.35,26.67 135.89,26.67 137.16,27.94 CN531.8
  Bottom 0.406: IC12.6 85.09,8.89 86.36,7.62 91.44,7.62 92.71,8.89 92.71,15.24 96.52,19.05 104.14,19.05 110.49,25.4 114.3,25.4 116.84,22.86 118.11,22.86 120.02,24.13 125.73,24.13 v128.27,27.94
DATAPIN  (via drill 0.9)
  Top 0.35: 46.99,51.44 86.36,51.44 90.17,55.24 v90.17,69.85
  Top 0.406: 46.99,51.44 43.18,47.62 v43.18,46.35
  Bottom 0.35: v90.17,69.85 92.08,71.75 92.08,83.19 96.52,87.63 B1.11
  Bottom 0.406: IC8.14 54.61,19.68 53.98,20.32 45.09,20.32 43.18,22.23 v43.18,46.35
DISO1  (via drill 0.9)
  Top 0.406: IC7.10 111.76,7.62 111.12,6.99 104.14,6.99 102.23,5.08 86.55,5.08 v86.36,5.27
  Bottom 0.406: v86.36,5.27 79.56,5.27 78.81,4.52 41.2,4.52 39.37,6.35 39.37,19.68 36.2,22.86 IC3.9
DISO2  (via drill 0.9)
  Top 0.406: IC7.9 109.22,12.06 109.86,12.7 111.76,12.7 114.3,15.24 114.3,31.11 116.2,33.02 119.19,33.02 v119.38,32.83
  Bottom 0.406: v119.38,32.83 IC4.10
DRUM1
  Top 0.406: R1.2 B1.A5
  Bottom 0.406: R1.2 D1.C DRUM.1
GND
  pour Top: -2.54,102.87 153.67,102.87 152.4,-2.54 -2.54,-2.54
  pour Bottom: -5.08,105.41 154.94,105.41 154.94,-5.08 -5.08,-5.08
GPI1
  Bottom 0.406: IC4.4 127,58.42 127.64,59.05 GPI.1 127,60.33 128.27,61.59 R2.1
GPI2
  Bottom 0.406: IC4.5 GPI.2 R3.1
GPI3
  Bottom 0.406: IC4.6 GPI.3 121.92,59.69 120.65,60.96 R4.1
GPO1
  Bottom 0.406: IC11.4 116.84,94.61 116.2,95.25 116.2,95.89 115.57,96.52 GPO.1
GPO2
  Bottom 0.406: IC11.5 114.3,95.25 113.03,96.52 GPO.2
GPO3
  Bottom 0.406: IC11.6 111.76,94.61 110.49,95.89 GPO.3
GPO4
  Bottom 0.406: IC11.7 109.22,95.25 107.95,96.52 GPO.4
GREEN1
  Bottom 0.406: PAD_LED.3 142.24,96.52 142.88,95.89 143.51,95.89 144.15,95.25 IC13.2
GREEN2
  Bottom 0.406: PAD_LED.6 134.62,96.52 135.25,95.89 135.89,95.89 136.53,95.25 IC13.5
GREEN3
  Bottom 0.406: PAD_LED.9 127,92.71 124.46,90.17 122.56,90.17 121.92,89.53 IC11.15
GREEN4
  Bottom 0.406: IC11.3 PAD_LED.12
INCLKPIN  (via drill 0.9)
  Top 0.406: IC7.2 v124.46,4.89 | v109.22,19.05 v109.22,52.89 109.22,71.12 104.14,76.2 B1.7
  Bottom 0.406: v109.22,19.05 109.22,13.97 106.68,11.43 v106.68,5.08 | IC4.2 132.08,53.34 131.44,52.7 109.41,52.7 v109.22,52.89 | v124.46,4.89 106.68,4.89 v106.68,5.08 | v106.68,5.08 104.78,5.08 103.5,3.81 29.21,3.81 25.4,7.62 25.4,13.34 22.23,16.51 21.59,16.51 20.95,17.14 IC3.2
INENPIN  (via drill 0.9)
  Top 0.35: 27.3,38.1 29.21,40.01 29.21,45.72 | 47.62,50.16 80.01,50.16 94.61,35.56 94.61,34.29 | 95.25,33.66 97.79,33.66 99.06,34.92 101.6,34.92
  Top 0.406: IC7.15 v124.46,12.7 | v119.38,18.86 119.38,19.05 122.56,22.23 122.56,25.14 v122.11,25.59 | B1.8 96.77,80.01 107.31,80.01 111.76,75.56 v111.76,49.53 v111.76,36.83 | 27.3,38.1 21.59,38.1 20.95,37.47 v20.95,30.48 | 29.21,45.72 29.84,46.35 33.66,46.35 36.2,43.81 45.72,43.81 46.35,44.45 46.35,48.9 47.62,50.16 | 94.61,34.29 95.25,33.66 | 101.6,34.92 102.23,34.92 104.14,33.02 v104.14,28.57
  Bottom 0.406: v124.46,12.7 124.46,14.61 123.19,15.88 118.75,15.88 118.11,16.51 118.11,17.78 118.75,18.41 118.93,18.41 v119.38,18.86 | v122.11,25.59 121.73,25.59 120.02,27.3 112.39,27.3 111.76,27.94 111.76,29.21 | 111.76,29.21 v111.76,36.83 | IC4.15 132.08,48.9 131.44,49.53 v111.76,49.53 | v20.95,30.48 IC3.15 | v104.14,28.57 106.05,28.57 106.68,29.21 111.76,29.21
INREADPIN  (via drill 0.9)
  Top 0.406: B1.9 96.9,83.19 100.97,83.19 102.23,81.92 107.95,81.92 114.94,74.93 v114.94,43.81
  Bottom 0.406: IC4.9 116.84,44.45 116.2,43.81 v114.94,43.81
KI_1
  Top 0.406: CN833.1 R22.1
  Bottom 0.406: R22.1 15.24,2.54 10.79,6.99 10.79,31.11 16.51,36.83 29.84,36.83 31.11,35.56 IC3.11
KI_2
  Top 0.406: R23.1 20.32,5.08 20.95,4.45 26.04,4.45 26.67,3.81 CN833.2
  Bottom 0.406: R23.1 16.51,6.35 12.7,10.16 12.7,30.48 17.14,34.92 27.3,34.92 28.57,33.66 IC3.12
KI_3
  Top 0.406: R24.1 20.32,8.89 20.95,8.26 26.67,8.26 29.21,5.71 CN833.3
  Bottom 0.406: R24.1 19.05,10.16 14.61,14.61 14.61,29.84 17.78,33.02 25.4,33.02 26.04,32.38 IC3.13
KI_4
  Top 0.406: R25.1 20.32,12.7 20.95,12.06 28.57,12.06 30.48,10.16 30.48,6.99 31.75,5.71 CN833.4
  Bottom 0.406: R25.1 19.68,13.97 16.51,17.14 16.51,22.86 17.78,24.13 22.86,24.13 23.5,24.77 IC3.14
KI_5
  Top 0.406: CN833.5 34.29,3.81 35.56,5.08 R26.1
  Bottom 0.406: IC3.3 23.5,17.14 26.67,13.97 28.57,13.97 33.66,8.89 33.66,6.99 34.29,6.35 R26.1
KI_6
  Top 0.406: CN833.6 36.83,3.81 38.1,5.08 38.1,8.89 36.83,10.16 R27.1
  Bottom 0.406: IC3.4 26.04,17.14 27.94,15.24 28.57,15.24 29.84,13.97 33.02,13.97 35.56,11.43 R27.1
KI_7
  Top 0.406: CN833.7 39.37,12.7 38.1,13.97 R28.1
  Bottom 0.406: IC3.5 28.57,17.14 30.48,15.24 34.29,15.24 R28.1
KI_8
  Top 0.406: CN832.1 115.57,30.48 116.2,31.11 130.18,31.11 132.08,29.21 R17.2
  Bottom 0.35: IC3.6 34.92,22.86 34.92,41.27 43.81,50.16 52.07,50.16 52.07,45.09 52.7,44.45 92.71,44.45 92.71,55.24
  Bottom 0.406: R17.2 131.44,29.21 129.54,31.11 118.11,31.11 117.47,31.75 117.47,40.64 116.2,41.91 110.49,41.91 104.78,47.62 104.78,54.61 104.14,55.24 92.71,55.24
KI_9
  Top 0.406: CN832.2 R18.2 118.11,22.86 115.57,20.32 115.57,13.34 114.3,12.06 IC7.11
KI_10
  Top 0.406: IC7.12 116.84,19.05 R19.2 119.38,22.86 120.65,24.13 CN832.3
KI_11
  Top 0.406: IC7.13 119.38,16.51 120.65,17.78 R20.2 123.19,17.78 124.46,19.05 124.46,25.4 123.19,26.67 CN832.4
KI_12
  Top 0.406: IC7.14 R21.2 122.85,13.97 123.07,14.18 125.94,14.18 127,15.24 127,25.4 125.73,26.67 CN832.5
KO_1  (via drill 0.9)
  Top 0.406: v46.99,6.35 CN831.1
  Bottom 0.406: IC8.15 52.07,14.61 51.44,13.97 48.26,13.97 46.99,12.7 v46.99,6.35
KO_2  (via drill 0.9)
  Top 0.406: CN831.2 v49.53,6.35
  Bottom 0.406: v49.53,6.35 IC8.1
KO_3  (via drill 0.9)
  Top 0.406: CN831.3 v52.07,6.35
  Bottom 0.406: IC8.2 v52.07,6.35
KO_4  (via drill 0.9)
  Top 0.406: CN831.4 v54.61,6.35
  Bottom 0.406: IC8.3 v54.61,6.35
KO_5  (via drill 0.9)
  Top 0.406: CN831.5 v57.15,6.35
  Bottom 0.406: IC8.4 v57.15,6.35
KO_6  (via drill 0.9)
  Top 0.406: CN831.6 v59.69,6.35
  Bottom 0.406: v59.69,6.35 IC8.5
KO_7  (via drill 0.9)
  Top 0.406: CN831.7 v62.23,6.35
  Bottom 0.406: IC8.6 v62.23,6.35
KO_8  (via drill 0.9)  (1 unrouted)
  Top 0.406: v64.77,6.35 64.77,2.7
  Bottom 0.406: IC8.7 v64.77,6.35
KO_9  (via drill 0.9)
  Top 0.406: v69.85,13.75 69.85,13.97 v74.93,13.97 | CN831.9 v67.31,6.35
  Bottom 0.406: v74.93,13.97 IC12.15 | v67.31,6.35 67.31,7.62 67.94,8.26 69.22,8.26 69.85,8.89 69.85,13.34 70.48,13.97 70.07,13.97 v69.85,13.75
KO_10  (via drill 0.9)
  Top 0.406: CN831.10 69.85,5.08 71.12,6.35 v72.39,6.35
  Bottom 0.406: v72.39,6.35 IC12.1
KO_11  (via drill 0.9)
  Top 0.406: v74.93,6.35 74.93,5.08 73.66,3.81 72.39,3.81 CN831.11
  Bottom 0.406: IC12.2 v74.93,6.35
KO_12  (via drill 0.9)
  Top 0.406: CN831.12 76.2,2.54 77.47,3.81 v77.47,6.35
  Bottom 0.406: IC12.3 v77.47,6.35
LATCHPIN  (via drill 0.9)
  Top 0.35: 135.89,90.17 v136.53,90.17 | 52.7,88.9 53.02,89.22 55.24,91.44 57.78,91.44 60.96,88.27 93.98,88.27 96.52,85.72 B1.10
  Top 0.406: B1.10 96.9,85.72 101.6,85.72 102.87,87 C1.1 104.14,92.71 106.05,90.81 113.03,90.81 113.67,90.17 v114.3,90.17 115.57,90.17 116.2,90.81 135.25,90.81 135.89,90.17 | v30.48,41.91 30.48,36.2 31.11,35.56 33.02,35.56 45.72,22.86 45.72,22.23 47.62,20.32 v59.69,20.32 v82.55,20.32 | v52.7,81.28 52.7,88.9 53.02,89.22
  Bottom 0.35: 52.07,77.47 46.35,71.75 46.35,55.88 33.02,42.55 30.48,42.55
  Bottom 0.406: IC11.12 v114.3,90.17 | IC13.12 v136.53,90.17 | IC9.12 26.04,46.99 30.48,42.55 v30.48,41.91 | IC8.12 v59.69,20.32 | v82.55,20.32 IC12.12 | 52.07,77.47 52.7,78.11 v52.7,81.28
LED_GND1  (via drill 0.9)
  Top 0.406: v3.81,34.29 4.45,34.29 5.71,35.56 5.71,49.43 v5.82,49.53
  Bottom 0.406: PAD_GND.1 v3.81,34.29 | v5.82,49.53 IC9.4
LED_GND2
  Bottom 0.406: PAD_GND.2 5.08,28.57 5.71,29.21 5.71,43.18 9.53,46.99 IC9.5
LED_GND3
  Bottom 0.406: PAD_GND.3 6.35,26.04 6.99,26.67 6.99,41.91 9.53,44.45 IC9.6
LED_GND4
  Bottom 0.406: PAD_GND.4 6.35,23.5 8.26,25.4 8.26,40.64 9.53,41.91 IC9.7
LOADPIN  (via drill 0.9)
  Top 0.406: IC7.1 130.81,2.54 v133.35,5.08 | v106.68,19.05 v106.68,51.44 106.68,70.48 103.5,73.66 B1.6 | v99.69,8.26 47.62,8.26 40.01,15.88 20.16,15.88 v19.92,16.11
  Bottom 0.406: v133.35,5.08 133.35,16.51 129.54,20.32 111.76,20.32 110.49,21.59 109.22,21.59 v106.68,19.05 106.68,13.34 101.6,8.26 v99.69,8.26 | IC4.1 134.62,52.07 133.99,51.44 v106.68,51.44 | v19.92,16.11 18.81,16.11 18.41,16.51 IC3.1
MUXAPIN  (via drill 0.9)
  Top 0.406: B1.2 v92.71,63.5 | v38.1,77.47 38.1,76.2 37.47,75.56 v22.23,75.56
  Bottom 0.406: MUXDATA.1 10.79,90.17 14.61,86.36 14.61,85.72 16.51,83.82 19.68,83.82 22.23,81.28 IC5.11 | IC5.11 22.23,78.11 | IC1.11 27.3,63.5 26.67,64.14 20.95,64.14 20.32,64.77 20.32,74.93 20.95,75.56 v22.23,75.56 IC5.11 | v92.71,63.5 87.63,63.5 85.09,66.04 85.09,84.45 81.92,87.63 53.98,87.63 50.16,91.44 47.62,91.44 45.09,88.9 45.09,87 43.18,85.09 43.18,84.45 41.91,83.19 41.91,81.92 41.27,81.28 41.27,80.01 38.73,77.47 v38.1,77.47
MUXBPIN  (via drill 0.9)
  Top 0.406: B1.3 v92.71,66.04 | v48.26,93.34 48.26,96.52 37.28,96.52 v36.83,96.97 | v5.08,87.63 5.08,90.17 8.26,93.34 10.16,93.34 12.06,95.25 13.78,95.25 v13.97,95.06
  Bottom 0.406: IC1.10 24.77,62.23 24.13,62.87 19.05,62.87 18.41,63.5 18.41,75.56 19.68,76.83 IC5.10 19.68,80.64 17.78,82.55 15.88,82.55 10.79,87.63 MUXDATA.2 v5.08,87.63 | v92.71,66.04 88.9,66.04 87,67.94 87,91.44 81.28,97.16 60.33,97.16 56.52,93.34 v48.26,93.34 | v36.83,96.97 15.88,96.97 v13.97,95.06
MUXCPIN  (via drill 0.9)
  Top 0.406: v53.34,95.89 53.34,96.52 55.24,98.42 82.55,98.42 88.9,92.08 v88.9,89.53 | 17.33,80.9 v17.14,81.09 17.33,81.28 19.05,81.28 19.68,80.64 24.77,80.64 25.4,81.28 36.2,81.28 36.83,80.64 v38.73,80.64 | B1.4 v92.71,68.58
  Bottom 0.406: MUXDATA.3 10.79,85.09 13.97,81.92 13.97,79.38 14.61,78.74 IC5.9 | IC5.9 17.14,61.59 18.41,60.33 IC1.9 | v53.34,95.89 46.35,95.89 45.09,94.61 45.09,91.44 43.18,89.53 43.18,87 38.73,82.55 v38.73,80.64 | IC5.9 v17.14,81.09 | v92.71,68.58 89.53,68.58 88.9,69.22 v88.9,89.53
MUXEN1  (via drill 0.9)
  Top 0.406: v27.3,70.48 38.1,70.48 41.91,74.3 81.92,74.3 85.09,71.12 B1.5
  Bottom 0.406: IC1.6 v27.3,70.48
MUXEN2  (via drill 0.9)
  Top 0.406: v92.71,92.71 96.27,92.71 B1.13
  Bottom 0.406: IC5.6 22.23,87.63 21.59,88.27 15.24,88.27 11.43,92.08 11.43,97.16 12.7,98.42 90.81,98.42 92.71,96.52 v92.71,92.71
MUXEN3
  Top 0.406: B1.14 MUXEN.1
MUXEN4
  Top 0.406: B1.15 MUXEN.2
MUXEN5
  Top 0.406: B1.16 MUXEN.3
MUXEN6
  Top 0.406: B1.17 MUXEN.4
MUXREADPIN  (via drill 0.9)
  Top 0.406: v9.53,96.52 24.77,96.52 25.4,97.16 29.21,97.16 29.84,96.52 v29.84,89.35 | v23.5,82.36 39.56,82.36 41.91,80.01 v45.09,80.01 | v45.09,71.12 B1.A0
  Bottom 0.406: MUXDATA.4 6.35,82.55 3.17,85.72 3.17,90.81 8.89,96.52 v9.53,96.52 | v29.84,89.35 IC5.3 29.84,85.72 27.3,83.19 24.13,83.19 23.5,82.55 v23.5,82.36 | v45.09,80.01 v45.09,71.12 45.09,66.04 44.45,65.41 35.56,65.41 34.92,66.04 IC1.3
N$4
  Bottom 0.406: IC8.9 67.31,19.68 67.94,20.32 76.83,20.32 77.47,19.68 IC12.14
OUTCLKPIN  (via drill 0.9)
  Top 0.35: v107.95,69.22 107.95,17.78 92.71,17.78 90.81,15.88 85.09,15.88 v85.09,15.43
  Top 0.406: B1.12 99.44,90.42 v99.69,90.17 | v67.31,15.21 84.87,15.21 v85.09,15.43 | v32.38,38.73 32.38,37.47 33.02,36.83 33.66,36.83 48.9,21.59 62.04,21.59 v62.23,21.78
  Bottom 0.35: v107.95,69.22 107.95,76.83
  Bottom 0.406: IC13.11 133.99,83.19 131.44,80.64 v114.94,80.64 | v99.69,90.17 99.69,87.63 103.5,83.82 104.14,83.82 104.78,83.19 109.86,83.19 112.39,80.64 v114.94,80.64 | IC11.11 111.76,83.82 113.03,82.55 114.3,82.55 114.94,81.92 v114.94,80.64 | v114.94,80.64 114.94,78.74 114.3,78.11 109.22,78.11 107.95,76.83 | IC9.11 25.4,44.45 28.57,41.27 28.57,40.01 29.84,38.73 v32.38,38.73 | v67.31,15.21 67.31,14.61 66.67,13.97 62.87,13.97 62.23,14.61 IC8.11 v62.23,21.78 | v85.09,15.43 IC12.11
POT1
  Bottom 0.406: IC1.13 POT_A.4
POT2
  Bottom 0.406: IC1.14 POT_A.3
POT3
  Bottom 0.406: IC1.15 POT_A.2
POT4
  Bottom 0.406: IC1.12 POT_A.5
POT5  (via drill 0.9)
  Top 0.406: v41.27,63.5 41.27,65.41 42.55,66.67 v42.55,67.94
  Bottom 0.406: POT_A.1 42.55,53.34 43.81,54.61 43.81,62.87 43.18,63.5 v41.27,63.5 | v42.55,67.94 IC1.1
POT6
  Bottom 0.406: IC1.5 29.84,69.22 31.11,70.48 POT_B.3
POT7
  Bottom 0.406: IC1.2 37.47,69.85 38.73,71.12 38.73,72.39 38.1,73.03 POT_B.1
POT8
  Bottom 0.406: POT_B.2 33.66,70.48 32.38,69.22 IC1.4
POT9
  Bottom 0.406: POT_B.5 26.04,74.93 27.3,76.2 IC5.13
POT10
  Bottom 0.406: IC5.14 29.84,76.2 28.57,74.93 POT_B.4
RED1
  Bottom 0.406: PAD_LED.1 147.32,96.52 148.59,95.25 148.59,90.81 147.32,89.53 145.41,89.53 144.15,88.27 IC13.15
RED2
  Bottom 0.406: PAD_LED.4 139.7,96.52 140.34,95.89 140.97,95.89 141.6,95.25 IC13.3
RED3
  Bottom 0.406: PAD_LED.7 132.08,97.16 133.99,95.25 IC13.6
RED4
  Bottom 0.406: IC11.1 PAD_LED.10
RX  (via drill 0.9)
  Top 0.406: B1.0 103.5,58.42 105.41,60.33 v105.41,65.41 | v142.88,66.04 CN601.4
  Bottom 0.406: v105.41,65.41 107.31,65.41 107.95,66.04 v142.88,66.04
SIDO2  (via drill 0.9)
  Top 0.406: v32.38,44.45 32.38,43.18 37.47,38.1 42.55,38.1 46.35,34.29 46.35,26.67 48.26,24.77 v48.9,24.77 | v85.09,20.95 86.99,20.95 87.03,20.91 87.04,20.91 87.63,20.32 90.01,20.32 v90.17,20.16
  Bottom 0.35: 81.92,23.5 59.69,23.5 58.42,22.23 50.16,22.23
  Bottom 0.406: IC9.14 21.59,52.07 24.13,49.53 28.57,49.53 32.38,45.72 v32.38,44.45 | 81.92,23.5 83.82,23.5 85.09,22.23 v85.09,20.95 | v90.17,20.16 IC12.9 | v48.9,24.77 48.9,23.5 50.16,22.23
SIDO3  (via drill 0.9)
  Top 0.406: v139.06,71.12 v139.06,64.14 | v24.13,39.37 27.3,39.37 27.94,40.01 27.94,46.35 31.75,50.16 42.55,50.16 45.09,52.7 45.09,68.58 43.18,70.48 43.18,71.75 44.45,73.03 79.38,73.03 85.72,66.67 87.63,66.67 88.9,65.41 v88.9,56.52
  Bottom 0.406: IC13.14 141.6,81.28 139.06,78.74 v139.06,71.12 | v139.06,64.14 132.72,64.14 132.08,64.77 119.38,64.77 111.12,56.52 v88.9,56.52 | IC9.9 v24.13,39.37
SIDO4
  Bottom 0.406: IC11.14 119.38,82.55 120.02,81.92 128.27,81.92 128.91,82.55 IC13.9
SPKL  (via drill 0.9)
  Top 0.406: CN131.3 8.26,57.15 8.89,57.78 v8.89,62.23
  Bottom 0.406: AUDIOJACK.4 AUDIOJACK.5 8.89,68.38 v8.89,62.23
SPKR  (via drill 0.9)
  Top 0.406: CN131.2 5.08,59.69 6.35,60.96 v6.35,62.23
  Bottom 0.406: AUDIOJACK.2 AUDIOJACK.3 8.73,76.2 6.99,76.2 6.35,75.56 v6.35,62.23
SPOT1
  Bottom 0.406: SPOT1.2 39.37,85.72 34.92,81.28 33.02,81.28 32.38,80.64 IC5.15
SPOT2
  Bottom 0.406: SPOT1.3 36.83,85.09 34.29,82.55 31.11,82.55 30.48,81.92 27.94,81.92 27.3,81.28 25.4,81.28 24.77,80.64 IC5.12
SPOT3
  Bottom 0.406: SPOT1.4 34.29,89.53 34.92,88.9 IC5.1
SPOT4
  Bottom 0.406: SPOT2.2 17.14,90.17 17.78,89.53 23.5,89.53 24.77,88.27 IC5.5
SPOT5
  Bottom 0.406: SPOT2.3 19.68,91.44 20.32,90.81 31.75,90.81 32.38,90.17 IC5.2
SPOT6  (via drill 0.9)
  Top 0.406: v27.3,89.35 v27.3,95.25
  Bottom 0.406: SPOT2.4 22.23,94.61 22.86,95.25 v27.3,95.25 | v27.3,89.35 IC5.4
SUSTAINPIN  (via drill 0.9)
  Top 0.406: v142.88,58.42 CN601.7
  Bottom 0.406: IC4.3 129.54,57.15 130.81,58.42 v142.88,58.42
SWITCH1
  Bottom 0.406: PAD_O.1 IC4.11
SWITCH2
  Bottom 0.406: IC4.12 PAD_O.2
SWITCH3
  Bottom 0.406: IC4.13 PAD_O.3
SWITCH4
  Bottom 0.406: IC4.14 PAD_O.4
SWT_GND1
  Bottom 0.406: PAD_GND.5 6.35,20.95 9.53,24.13 9.53,31.75 15.88,38.1 15.88,53.34 17.14,54.61 IC9.15
SWT_GND2  (via drill 0.9)
  Top 0.406: v6.35,54.61 6.35,53.98 7.62,52.7 7.62,19.05 6.99,18.41 v6.35,18.41
  Bottom 0.406: IC9.1 8.26,57.15 7.62,56.52 6.99,56.52 6.35,55.88 v6.35,54.61 | PAD_GND.6 v6.35,18.41
SWT_GND3  (via drill 0.9)
  Top 0.406: v8.89,17.14 v8.89,54.61
  Bottom 0.406: PAD_GND.7 7.62,15.88 v8.89,17.14 | v8.89,54.61 IC9.2
SWT_GND4  (via drill 0.9)
  Top 0.406: v5.08,8.26 10.16,8.26 10.79,8.89 v10.79,36.2
  Bottom 0.406: PAD_GND.8 3.81,8.89 4.45,8.26 v5.08,8.26 | v10.79,36.2 12.06,36.2 13.97,38.1 13.97,51.44 13.34,52.07 IC9.3
T_CLK  (via drill 0.9)
  Top 0.35: 93.34,32.54 101.28,32.54 102.39,31.43 102.39,23.18
  Top 0.406: 93.34,32.54 93.19,32.54 92.08,33.66 91.44,33.66 88.9,36.2 80.64,36.2 80.01,35.56 v80.01,34.29 | 102.39,23.18 102.39,23.02 100.97,21.59 92.71,21.59 91.44,22.86 B1.25
  Bottom 0.406: v80.01,34.29 TFT_DISPLAY.10
T_CS  (via drill 0.9)
  Top 0.406: B1.26 88.9,29.21 87.15,30.96 85.88,30.96 84.45,32.38 83.19,32.38 82.55,33.02 v82.55,34.29
  Bottom 0.406: TFT_DISPLAY.11 v82.55,34.29
T_DIN  (via drill 0.9)
  Top 0.35: 91.44,31.75 101.12,31.75 101.6,31.27
  Top 0.406: v88.9,23.5 B1.27 | 101.6,31.27 101.6,23.5 100.97,22.86 94.17,22.86 v93.98,23.05 | 91.44,31.75 89.53,31.75 87,34.29 v85.09,34.29
  Bottom 0.406: v93.98,23.05 89.35,23.05 v88.9,23.5 | TFT_DISPLAY.12 v85.09,34.29
T_DOUT  (via drill 0.9)
  Top 0.35: 91.44,21.59 87.31,21.59 86.36,22.54 B1.29 | 102.23,21.59 v104.14,21.59
  Top 0.406: 110.49,27.94 v110.49,27.3 110.49,33.02 113.22,35.75 v113.22,62.23 | v105.22,57.97 105.03,57.78 104.14,57.78 103.35,56.99 102.08,56.99 100.97,55.88 93.34,55.88 92.71,55.24 v92.71,42.55 | 91.44,21.59 92.71,20.32 100.97,20.32 102.23,21.59
  Bottom 0.406: v110.49,27.3 107.31,27.3 104.14,24.13 v104.14,21.59 | v105.22,57.97 106.23,57.97 110.49,62.23 v113.22,62.23 | v92.71,42.55 88.9,42.55 87.63,41.27 TFT_DISPLAY.13
T_IRQ  (via drill 0.9)
  Top 0.406: B1.30 83.82,28.53 83.8,28.55 83.8,29.87 83.19,30.48 v81.28,30.48
  Bottom 0.406: v81.28,30.48 86.36,30.48 90.17,34.29 TFT_DISPLAY.14
TFT_CS  (via drill 0.9)
  Top 0.35: 51.91,28.57 51.91,24.77 | 52.7,23.97 59.53,23.97
  Top 0.406: 51.91,28.57 51.91,30.32 57.78,36.2 62.04,36.2 v62.23,36.38 | 51.91,24.77 52.7,23.97 | 59.53,23.97 60.8,23.97 60.96,24.13 B1.49
  Bottom 0.406: v62.23,36.38 TFT_DISPLAY.3
TFT_D/C  (via drill 0.9)
  Top 0.406: B1.48 60.96,29.84 62.23,31.11 64.14,31.11 67.31,34.29 v67.31,36.38
  Bottom 0.406: v67.31,36.38 TFT_DISPLAY.5
TFT_RESET  (via drill 0.9)  (1 unrouted)
  Top 0.406: v53.98,35.56 53.98,33.66 50.64,30.32 50.64,27.78 | v59.05,34.29 64.14,34.29 64.77,34.92 v64.77,36.38 | B1.47 63.5,23.5 63.18,23.18 61.28,23.18 60.96,22.86 52.07,22.86 50.64,24.29 50.64,27.94
  Bottom 0.406: v64.77,36.38 TFT_DISPLAY.4 | v53.98,35.56 55.88,35.56 57.15,34.29 v59.05,34.29
TFT_SCK  (via drill 0.9)
  Top 0.406: B1.52 v55.88,30.48
  Bottom 0.406: TFT_DISPLAY.7 72.39,37.47 69.85,34.92 66.04,34.92 63.57,32.46 62.57,32.46 62.5,32.38 57.15,32.38 55.88,31.11 v55.88,30.48
TFT_SDI  (via drill 0.9)
  Top 0.406: v51.44,34.29 51.44,36.2 50.48,37.15 50.48,46.67 52.7,48.9 60.33,48.9 60.96,48.26 60.96,46.99 62.23,45.72 68.58,45.72 69.85,44.45 v69.85,42.55
  Bottom 0.35: 51.91,26.99 51.91,24.77 52.7,23.97 56.52,23.97 56.83,23.97 | B1.51 58.26,25.4
  Bottom 0.406: v51.44,34.29 51.44,27.46 51.91,26.99 | 56.52,23.97 58.26,23.97 58.42,24.13 B1.51 | v69.85,42.55 TFT_DISPLAY.6
TFT_SDO  (via drill 0.9)
  Top 0.406: v58.42,30.48 B1.50
  Bottom 0.406: v58.42,30.48 61.59,30.48 62.87,31.75 76.83,31.75 77.47,32.38 TFT_DISPLAY.9
TX  (via drill 0.9)
  Top 0.406: B1.1 103.5,60.96 104.14,61.59 v104.14,67.94 | CN601.3 v142.88,68.58
  Bottom 0.406: v104.14,67.94 140.97,67.94 141.6,68.58 v142.88,68.58
VIN  (via drill 0.9)
  Top 0.406: v56.52,90.17 56.52,77.47 55.24,76.2 B1.VIN
  Bottom 0.406: IC10.OUT 62.23,91.44 C3.1 | C3.1 60.96,89.53 | C3.1 v56.52,90.17
VIN12V
  Bottom 0.406: IC10.IN 67.31,90.81 67.94,90.17 C2.1 71.12,90.17 71.75,90.81 POWER.1
X1_1  (via drill 0.9)
  Top 0.406: B1.A1 v57.78,68.58
  Bottom 0.406: TOUCH/PAN.1 v57.78,68.58
X2_1  (via drill 0.9)
  Top 0.406: B1.A2 v57.78,66.04
  Bottom 0.406: TOUCH/PAN.2 v57.78,66.04
Y1_1  (via drill 0.9)
  Top 0.406: B1.A3 v57.78,63.5
  Bottom 0.406: TOUCH/PAN.3 v57.78,63.5
Y2_1  (via drill 0.9)
  Top 0.406: B1.A4 v57.78,60.96
  Bottom 0.406: TOUCH/PAN.4 v57.78,60.96